# Altium schematic sheet 位移（应变）监测站.SchDoc
size A3
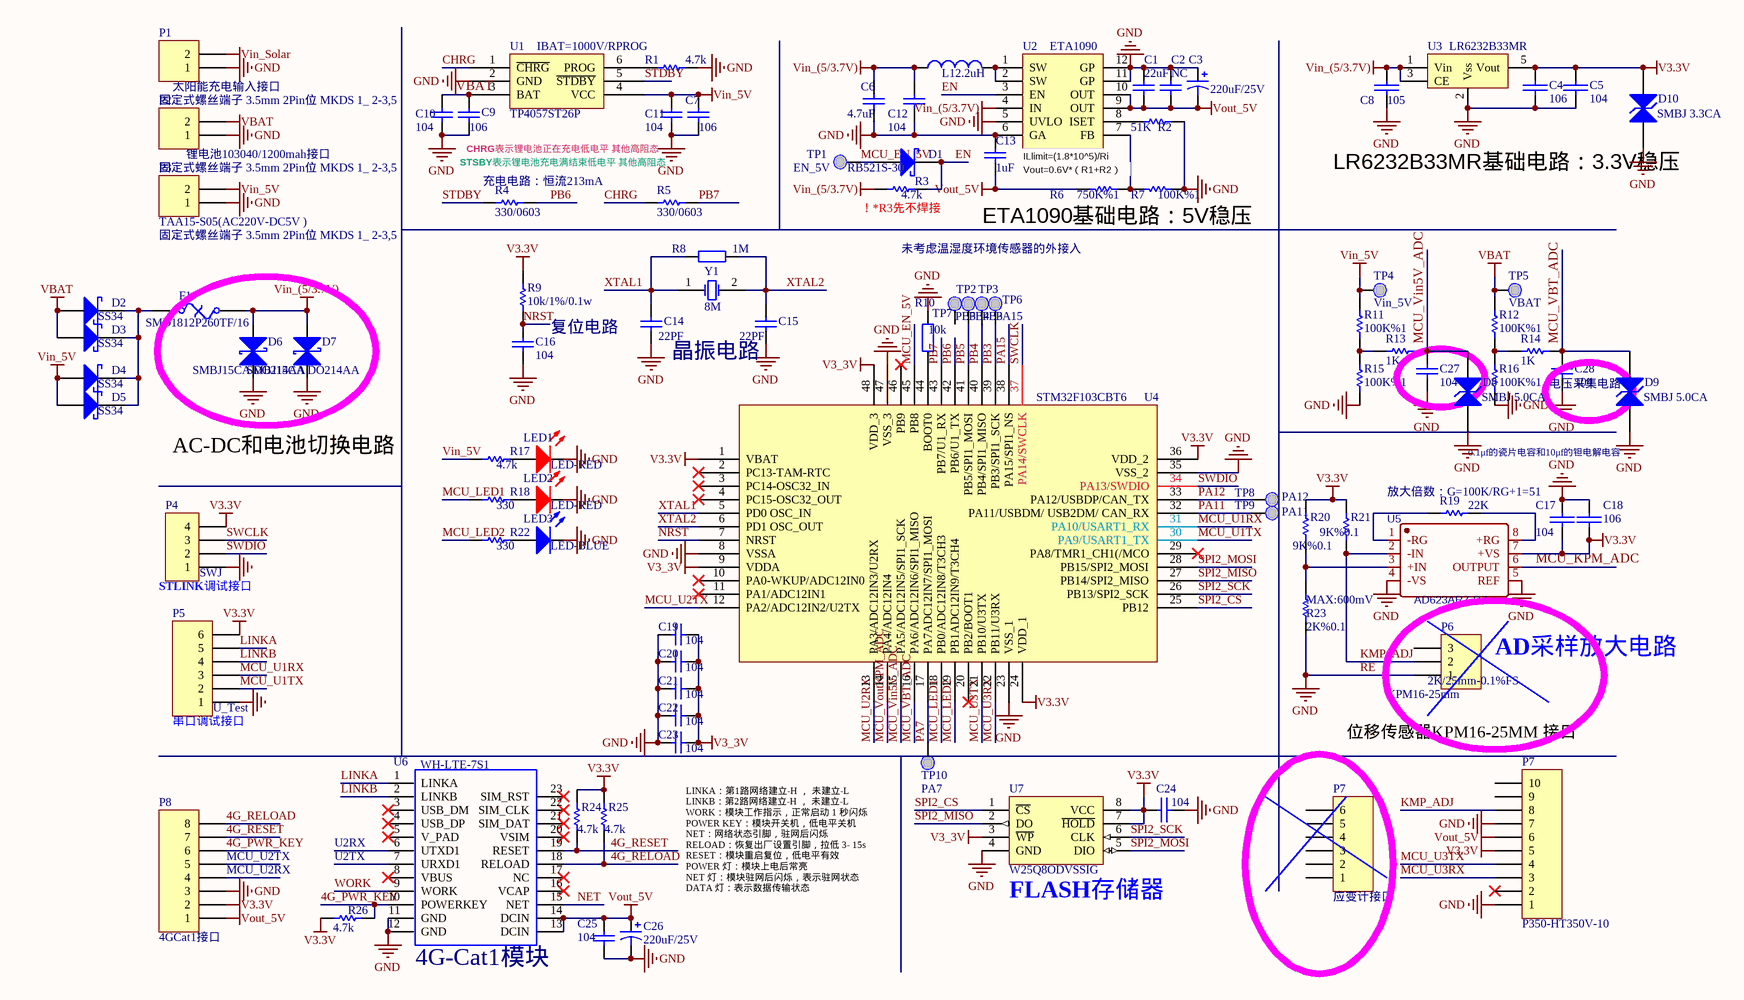
[diagram p0: 位移（应变）监测站.SchDoc]

## Parts
(Parts that share a designator on the sheet are numbered #1, #2 ... from top to bottom, then left to right.)
C1  22uF  [C0805]
C2  value NC  [C0805]  (hidden comment: Cap)
C3  220uF/25V  [C_6032]
C4  106  [C0603]
C5  104  [C0603]
C6  value 4.7uF  [C0603]  (hidden comment: Cap)
C7  106  [C0603]
C8  105  [C0603]
C9  106  [C0603]
C10  104  [C0603]
C11  104  [C0603]
C12  value 104  [C0603]  (hidden comment: Cap)
C13  1uF  [C0603]
C14  22PF  [C0603]
C15  22PF  [C0603]
C16  104  [C0603]
C17  104  [C0603]
C18  106  [3216]
C19  104  [C0603]
C20  104  [C0603]
C21  104  [C0603]
C22  104  [C0603]
C23  104  [C0603]
C24  104  [C0603]
C25  104  [C0603]
C26  220uF/25V  [C_6032]
C27  104  [C0603]
C28  104  [C0603]
D1  RB521S-30  [DO-214AB(SMC)]
D2  SS34  [DO-214AB(SMC)]
D3  SS34  [DO-214AB(SMC)]
D4  SS34  [DO-214AB(SMC)]
D5  SS34  [DO-214AB(SMC)]
D6  SMBJ15CA DO214AA  [DO-214AA]
D7  SMBJ15CA DO214AA  [DO-214AA]
D8  SMBJ 5.0CA  [DO-214AA]
D9  SMBJ 5.0CA  [DO-214AA]
D10  SMBJ 3.3CA  [DO-214AA]
F1  SMD1812P260TF/16  [1812]
L1  value 2.2uH  [L_8X8]  (hidden comment: Inductor)
LED1  LED-RED  [0603_LED]
LED2  LED-RED  [0603_LED]
LED3  LED-BLUE  [0603_LED]
P1  固定式螺丝端子 3.5mm 2Pin位 MKDS 1_ 2-3,5  [CONN-TH_MKDS1/2-3.5]
P2  固定式螺丝端子 3.5mm 2Pin位 MKDS 1_ 2-3,5  [CONN-TH_MKDS1/2-3.5]
P3  固定式螺丝端子 3.5mm 2Pin位 MKDS 1_ 2-3,5  [CONN-TH_MKDS1/2-3.5]
P4  SWJ  [HDR1X4]
P5  U_Test  [HDR1X6]
P6  (no value)  [MHDR1X3]
P7#1  应变计接口  [P350-HT350V-10]
P7#2  P350-HT350V-10  [P350-HT350V-10]
P8  4GCat1接口  [HDR1X8H]
R1  4.7k  [R0603]
R2  51K  [R0603]
R3  4.7k  [R0603]
R4  330/0603  [R0603]
R5  330/0603  [R0603]
R6  750K%1  [R0603]
R7  100K%1  [R0603]
R8  1M  [R0603]
R9  10k/1%/0.1w  [R0603]
R10  10k  [R0603]
R11  100K%1  [R0603]
R12  100K%1  [R0603]
R13  1K  [R0603]
R14  1K  [R0603]
R15  100K%1  [R0603]
R16  100K%1  [R0603]
R17  4.7k  [R0603]
R18  330  [R0603]
R19  22K  [R0603]
R20  9K%0.1  [R0603]
R21  9K%0.1  [R0603]
R22  330  [R0603]
R23  2K%0.1  [R0603]
R24  4.7k  [R0603]
R25  4.7k  [R0603]
R26  4.7k  [R0603]
TP1  EN_5V  [TESTPOINT_1*1mm]
TP2  PB4  [TESTPOINT_1*1mm]
TP3  PB3  [TESTPOINT_1*1mm]
TP4  Vin_5V  [TESTPOINT_1*1mm]
TP5  VBAT  [TESTPOINT_1*1mm]
TP6  PA15  [TESTPOINT_1*1mm]
TP7  PB5  [TESTPOINT_1*1mm]
TP8  PA12  [TESTPOINT_1*1mm]
TP9  PA11  [TESTPOINT_1*1mm]
TP10  PA7  [TESTPOINT_1*1mm]
U1  TP4057ST26P  [SOT23-6L]
U2  ETA1090  [DFN3x3_12]
U3  LR6232B33MR  [SOT23-5_LR6232B33M]
U4  STM32F103CBT6  [STM32F103CBT6]
U5  AD623ARZ-R7  [SOIC-8_L5.0-W4.0-P1.27-LS6.0-BL]
U6  WH-LTE-7S1  [WH-LTE-7S1]
U7  W25Q8ODVSSIG  [SOIC-8 208-mil]
Y1  8M  [XT_SMD_5032_2P]

## Nets
RE: C1.2 C2.2 C3.1 C4.2 C5.2 C6.1 C7.2 C8.2 C9.2 C10.1 C11.1 C12.1 C13.2 C14.2 C15.2 C16.2 C17.2 C18.2 C19.2 C20.2 C21.2 C22.2 C23.2 C24.2 C25.1 C26.2 C27.2 C28.2 D6.1(A) D7.1(A) D8.1(A) D9.1(A) D10.1(A) LED1.2(K) LED2.2(K) LED3.2(K) P1.1 P2.1 P3.1 P4.1 P5.1 P6.1 P7#2.1 P7#2.7 P8.3 R1.1 R2.1 R7.1 R10.1 R15.2 R16.1 R23.1 U1.2(GND) U2.5(UVLO) U2.6(GA) U2.11(GP) U2.12(GP) U3.2(Vss) U4.8(VSSA) U4.23(VSS_1) U4.35(VSS_2) U4.47(VSS_3) U5.4(-VS) U5.5(REF) U6.11(GND) U6.12(GND) U7.4(GND)  [also labelled GND]
V3.3V: C4.1 C5.1 C17.1 C18.1 C24.1 D10.2(K) P4.4 P5.6 P7#2.5 P8.2 R9.2 R20.2 R21.1 R24.1 R25.1 R26.2 U3.5(Vout) U4.1(VBAT) U4.24(VDD_1) U4.36(VDD_2) U5.7(+VS) U7.7(~{HOLD}) U7.8(VCC)
V3_3V: C19.1 C20.1 C21.1 C22.1 C23.1 U4.9(VDDA) U4.48(VDD_3) U7.3(~{WP})
VBAT: C9.1 C10.2 D2.1(A) D3.1(A) P2.2 R12.2 TP5.1(T) U1.3(BAT)
Vin_5V: C7.1 C11.2 D4.1(A) D5.1(A) P3.2 R11.1 R17.1 TP4.1(T) U1.4(VCC)
Vin_(5/3.7V): C6.2 C8.1 C12.2 D6.2(K) D7.2(K) F1.2 L1.2 R3.1 U2.4(IN) U3.1(Vin) U3.3(CE)
Vin_Solar: P1.2
Vout_5V: C1.1 C2.1 C3.2 C13.1 C25.2 C26.1 P7#2.6 P8.1 R6.2 U2.9(OUT) U2.10(OUT) U6.13(DCIN) U6.14(DCIN)
4G_PWR_KEY: P8.6 R26.1 U6.10(POWERKEY)
4G_RELOAD: P8.8 R25.2 U6.18(RELOAD)
4G_RESET: P8.7 R24.2 U6.19(RESET)
CHRG: R5.1 U1.1(~{CHRG})
EN: D1.2(K) R3.2 U2.3(EN)
KMP_ADJ: P6.2 P7#2.8 R21.2 U5.2(-IN)
LINKA: P5.5 U6.1(LINKA)
LINKB: P5.4 U6.2(LINKB)
MCU_EN_5V: D1.1(A) TP1.1(T) U4.45(PB8)
MCU_KPM_ADC: U5.6(OUTPUT)
MCU_LED1: R18.1 U4.18(PB0/ADC12IN8/T3CH3)
MCU_LED2: R22.1 U4.19(PB1ADC12IN9/T3CH4)
MCU_U1RX: P5.3 U4.31(PA10/USART1_RX)
MCU_U1TX: P5.2 U4.30(PA9/USART1_TX)
MCU_U2RX: P8.4 U4.13(PA3/ADC12IN3/U2RX)
MCU_U2TX: P8.5 U4.12(PA2/ADC12IN2/U2TX)
MCU_U3RX: P7#2.3 U4.22(PB11/U3RX)
MCU_U3TX: P7#2.4 U4.21(PB10/U3TX)
MCU_VBT_ADC: C28.1 D9.2(K) R14.1 U4.16(PA6/ADC12IN6/SPI1_MISO)
MCU_Vin5V_ADC: C27.1 D8.2(K) R13.2 U4.15(PA5/ADC12IN5/SPI1_SCK)
MCU_VoutKPM_ADC: U4.14(PA4/ADC12IN4)
NET: U6.15(NET)
NRST: C16.1 R9.1 U4.7(NRST)
PA7: TP10.1(T) U4.17(PA7ADC12IN7/SPI1_MOSI)
PA11: TP9.1(T) U4.32(PA11/USBDM/_USB2DM/_CAN_RX)
PA12: TP8.1(T) U4.33(PA12/USBDP/CAN_TX)
PA15: U4.38(PA15/SPI1_NS)
PB3: TP6.1(T) U4.39(PB3/SPI1_SCK)
PB4: TP3.1(T) U4.40(PB4/SPI1_MISO)
PB5: TP2.1(T) U4.41(PB5/SPI1_MOSI)
PB6: R4.2 U4.42(PB6/U1_TX)
PB7: R5.2 U4.43(PB7/U1_RX)
SPI2_CS: U4.25(PB12) U7.1(~{CS})
SPI2_MISO: U4.27(PB14/SPI2_MISO) U7.2(DO)
SPI2_MOSI: U4.28(PB15/SPI2_MOSI) U7.5(DIO)
SPI2_SCK: U4.26(PB13/SPI2_SCK) U7.6(CLK)
STDBY: R4.1 U1.5(~{STDBY})
SWCLK: P4.3 U4.37(PA14/SWCLK)
SWDIO: P4.2 U4.34(PA13/SWDIO)
U2RX: U6.6(UTXD1)
U2TX: U6.7(URXD1)
WORK: U6.9(WORK)
XTAL1: C14.1 R8.2 U4.5(PD0_OSC_IN) Y1.1(OSC1)
XTAL2: C15.1 R8.1 U4.6(PD1_OSC_OUT) Y1.2(OSC2)
NetD2_2: D2.2(K) D3.2(K) D4.2(K) D5.2(K) F1.1
NetL1_1: L1.1 U2.1(SW) U2.2(SW)
NetLED1_1: LED1.1(A) R17.2
NetLED2_1: LED2.1(A) R18.2
NetLED3_1: LED3.1(A) R22.2
NetR1_2: R1.2 U1.6(PROG)
NetR2_2: R2.2 U2.8(ISET)
NetR6_1: R6.1 R7.2 U2.7(FB)
NetR10_2: R10.2 U4.44(BOOT0)
NetR11_2: R11.2 R13.1 R15.1
NetR12_1: R12.1 R14.2 R16.2
NetR19_1: R19.1 U5.8(+RG)
NetR19_2: R19.2 U5.1(-RG)
NetR20_1: R20.1 R23.2 U5.3(+IN)

Not connected (* = marked no-connect by the designer): P6 3; P7#1 1 2 3 4 5 6; P7#2 2* 9 10; TP7 1(T); U3 4(NC); U4 2(PC13-TAM-RTC)* 3(PC14-OSC32_IN)* 4(PC15-OSC32_OUT)* 10(PA0-WKUP/ADC12IN0)* 11(PA1/ADC12IN1)* 20(PB2/BOOT1)* 29(PA8/TMR1_CH1(/MCO)* 46(PB9)*; U6 3(USB_DM)* 4(USB_DP)* 5(V_PAD)* 8(VBUS)* 16(VCAP)* 17(NC)* 20(VSIM)* 21(SIM_DAT)* 22(SIM_CLK)* 23(SIM_RST)*

## Notes on the sheet
- (near P1) 太阳能充电输入接口
- (near U1) IBAT=1000V/RPROG
- (near P2) 锂电池103040/1200mah接口
- CHRG表示锂电池正在充电低电平 其他高阻态
- STSBY表示锂电池充电满结束低电平 其他高阻态
- Vout=0.6V*（R1+R2）/R2
- (near U2) ILlimit=(1.8*10^5)/Ri
- LR6232B33MR基础电路：3.3V稳压
- (near P3) TAA15-S05(AC220V-DC5V )
- (near R4) 充电电路：恒流213mA
- (near R3) ！*R3先不焊接
- ETA1090基础电路：5V稳压
- 未考虑温湿度环境传感器的外接入
- 复位电路
- (near C14) 晶振电路
- (near C28) 电压采集电路
- AC-DC和电池切换电路
- (near R19) 放大倍数：G=100K/RG+1=51
- 0.1μf的瓷片电容和10μf的钽电解电容
- (near P4) STLINK调试接口
- (near R23) MAX:600mV
- (near P6) KPM16-25mm
- (near P6) 2K/25mm-0.1%FS
- AD采样放大电路
- (near P5) 串口调试接口
- 位移传感器KPM16-25MM 接口
- LINKA：第1路网络建立-H ， 未建立-L
  LINKB：第2路网络建立-H ， 未建立-L
  WORK：模块工作指示，正常启动 1 秒闪烁
  POWER KEY：模块开关机，低电平关机
  NET：网络状态引脚，驻网后闪烁
  RELOAD：恢复出厂设置引脚，拉低 3- 15s
  RESET：模块重启复位，低电平有效
  POWER 灯：模块上电后常亮
  NET 灯：模块驻网后闪烁，表示驻网状态
  DATA 灯：表示数据传输状态
- (near U7) FLASH存储器
- (near U6) 4G-Cat1模块

## Library data of the parts
C1 C2 C6 C12-C15 = Cap: Capacitor; Published: 8-Jun-2000; LatestRevisionDate: 17-Jul-2002; LatestRevisionNote: Re-released for DXP Platform.; PackageReference: RAD-0.3; Publisher: Altium Limited
C3 C26 = Cap Pol1: Polarized Capacitor (Radial); Published: 8-Jun-2000; LatestRevisionDate: 17-Jul-2002; LatestRevisionNote: Re-released for DXP Platform.; PackageReference: RB7.6-15; Publisher: Altium Limited
C4 C5 C8 C17 C24 = CAP_1: 贴片电容
C7 C9-C11 = CAP: 贴片电容; Value: 100nF; Published: 8-Jun-2000; Revision: July-2002: Re-released for DXP Platform.; Publisher: Altium Limited
C16 C27 C28 = Cap: Capacitor; Value: 10nF; Published: 8-Jun-2000; Revision: July-2002: Re-released for DXP Platform.; Publisher: Altium Limited
C18 = CAP_1: 钽电容
C19-C23 C25 = CAP: Capacitor; Value: 100nF; Published: 8-Jun-2000; Revision: July-2002: Re-released for DXP Platform.; Publisher: Altium Limited
D1-D5 = D Schottky: 肖特基二极管
D6 D7 = TVS
D8-D10 = SMB/DO-214AA P6SMB6.8CA: TVS; ComponentLink1Description: 供应商链接; ComponentLink1URL: http://www.szlcsc.com/product/details_79530.html; Package: SMB/DO-214AA; Supplier: LC; SuppliersPartNumber: C78395
F1 = Fuse Thermal: Thermal Fuse; Published: 24-Mar-1999; LatestRevisionDate: 17-Jul-2002; LatestRevisionNote: Re-released for DXP Platform.; PackageReference: PIN-W2/E2.8; Publisher: Altium Limited
L1 = Inductor: Code_IEC: 1005; Published: 8-Jun-2000; LatestRevisionDate: 17-Jul-2002; LatestRevisionNote: Re-released for DXP Platform.; PackageReference: 0402-A; Publisher: Altium Limited; Code_JEITA: 0402
LED1 LED2 = LED-RED: 发光二极管
LED3 = LED-BLUE: 发光二极管
P1-P3 = Header 2: Header, 2-Pin; LatestRevisionDate: 17-Jul-2002; LatestRevisionNote: Re-released for DXP Platform.; Publisher: Altium Limited
P4 = header4: 2.54接口，4pin
P5 = Header 6: Header, 6-Pin; LatestRevisionDate: 17-Jul-2002; LatestRevisionNote: Re-released for DXP Platform.; Publisher: Altium Limited
P6 = MHDR1X3: 航空插排（座）, 3-Pin; LatestRevisionDate: 17-Jul-2002; LatestRevisionNote: Re-released for DXP Platform.; Publisher: Altium Limited
P7#1 = Header 6H: Header, 6-Pin, Right Angle; LatestRevisionDate: 17-Jul-2002; LatestRevisionNote: Re-released for DXP Platform.; Publisher: Altium Limited
P7#2 = Header 10: Header, 10-Pin; LatestRevisionDate: 17-Jul-2002; LatestRevisionNote: Re-released for DXP Platform.; Publisher: Altium Limited
P8 = Header 8H: 4G接插口 8-Pin, Right Angle; LatestRevisionDate: 17-Jul-2002; LatestRevisionNote: Re-released for DXP Platform.; Publisher: Altium Limited
R1 R3 R11-R23 = RES1: 贴片电阻
R2 R4-R7 R24-R26 = Res1: Resistor; Value: 1K; Published: 8-Jun-2000; Publisher: Altium Limited
  R2 R6 R7: LatestRevisionDate: 17-Jul-2002; LatestRevisionNote: Re-released for DXP Platform.; PackageReference: AXIAL-0.3
  R4 R5 R24-R26: Revision: July-2002: Re-released for DXP Platform.
R8 R10 = Res2: Resistor; Published: 8-Jun-2000; LatestRevisionDate: 17-Jul-2002; LatestRevisionNote: Re-released for DXP Platform.; PackageReference: AXIAL-0.4; Publisher: Altium Limited
R9 = res1: Resistor; Value: 1K; Published: 8-Jun-2000; Revision: July-2002: Re-released for DXP Platform.; Publisher: Altium Limited
TP1-TP10 = TEST_Piont
U1 = Component_1: 充电芯片
U2 = Header 6X2H: 5V稳压电路; LatestRevisionDate: 17-Jul-2002; LatestRevisionNote: Re-released for DXP Platform.; Publisher: Altium Limited
U3 = XC6221-xxxMR: 3.3V稳压芯片
U4 = Component_1: MCU主控
U5 = AD623ARZ-R7: BOM_Manufacturer: ADI; SMT Type: Extend; spicePre: X; BOM_Supplier: LCSC; BOM_Manufacturer Part: AD623ARZ-R7; image: //image.lceda.cn/szlcsc/C9676.jpg; BOM_Supplier Part: C9676; BOM_JLCPCB SMD: Yes; spiceSymbolName: AD623ARZ-R7
U6 = WH-LTE-7S1: 4G-Cat1模块; PCB DECAL: WH-LTE-7S1
U7 = W25-Series: 华邦 NOR Flash存储器/SOIC-8 208-mil
Y1 = XTAL: Crystal Oscillator; Published: 8-Jun-2000; LatestRevisionDate: 17-Jul-2002; LatestRevisionNote: Re-released for DXP Platform.; PackageReference: R38; Publisher: Altium Limited